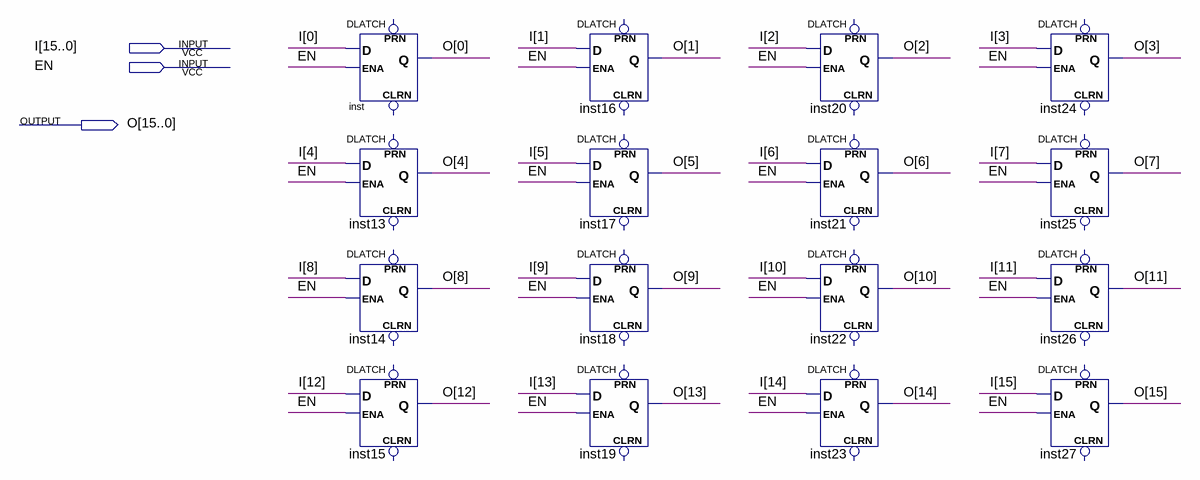
[diagram p0: schematic sheet]
// Quartus schematic DLATCH_16bit.bdf as structural Verilog: 16 symbols, 3 pins
module DLATCH_16bit (
  input  [15:0] I,
  input  EN,
  output [15:0] O
);

  DLATCH inst (.D(I[0]), .ENA(EN), .Q(O[0]));  // open: CLRN, PRN
  DLATCH inst13 (.D(I[4]), .ENA(EN), .Q(O[4]));  // open: CLRN, PRN
  DLATCH inst14 (.D(I[8]), .ENA(EN), .Q(O[8]));  // open: CLRN, PRN
  DLATCH inst15 (.D(I[12]), .ENA(EN), .Q(O[12]));  // open: CLRN, PRN
  DLATCH inst16 (.D(I[1]), .ENA(EN), .Q(O[1]));  // open: CLRN, PRN
  DLATCH inst17 (.D(I[5]), .ENA(EN), .Q(O[5]));  // open: CLRN, PRN
  DLATCH inst18 (.D(I[9]), .ENA(EN), .Q(O[9]));  // open: CLRN, PRN
  DLATCH inst19 (.D(I[13]), .ENA(EN), .Q(O[13]));  // open: CLRN, PRN
  DLATCH inst20 (.D(I[2]), .ENA(EN), .Q(O[2]));  // open: CLRN, PRN
  DLATCH inst21 (.D(I[6]), .ENA(EN), .Q(O[6]));  // open: CLRN, PRN
  DLATCH inst22 (.D(I[10]), .ENA(EN), .Q(O[10]));  // open: CLRN, PRN
  DLATCH inst23 (.D(I[14]), .ENA(EN), .Q(O[14]));  // open: CLRN, PRN
  DLATCH inst24 (.D(I[3]), .ENA(EN), .Q(O[3]));  // open: CLRN, PRN
  DLATCH inst25 (.D(I[7]), .ENA(EN), .Q(O[7]));  // open: CLRN, PRN
  DLATCH inst26 (.D(I[11]), .ENA(EN), .Q(O[11]));  // open: CLRN, PRN
  DLATCH inst27 (.D(I[15]), .ENA(EN), .Q(O[15]));  // open: CLRN, PRN
endmodule
